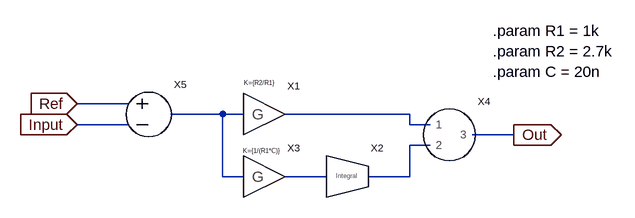
[diagram p0: schematic PI_Controller.asc]
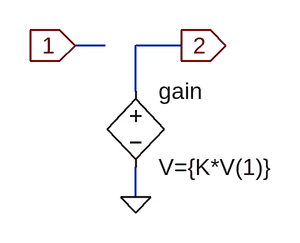
[diagram p1: sub-circuit gain.asc]
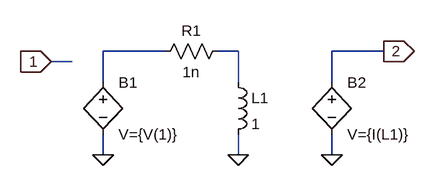
[diagram p2: sub-circuit integral.asc]
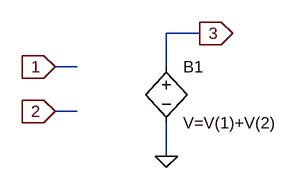
[diagram p3: sub-circuit adder.asc]
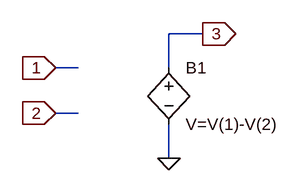
[diagram p4: sub-circuit subtractor.asc]
PI_Controller.asc, the LTspice schematic file:
Version 4
SHEET 1 880 680
WIRE -144 16 -224 16
WIRE 0 32 -80 32
WIRE 32 32 0 32
WIRE 288 32 96 32
WIRE -144 48 -224 48
WIRE 288 48 288 32
WIRE 320 48 288 48
WIRE 448 64 384 64
WIRE 320 80 288 80
WIRE 0 128 0 32
WIRE 32 128 0 128
WIRE 160 128 96 128
WIRE 288 128 288 80
WIRE 288 128 224 128
FLAG -224 16 Ref
IOPIN -224 16 In
FLAG -224 48 Input
IOPIN -224 48 In
FLAG 448 64 Out
IOPIN 448 64 Out
SYMBOL Gain 64 32 R0
WINDOW 39 -31 -48 Left 0
SYMATTR SpiceLine K={R2/R1}
SYMATTR InstName X1
SYMBOL Integral 192 128 R0
SYMATTR InstName X2
SYMBOL Gain 64 128 R0
WINDOW 39 -33 -40 Left 0
SYMATTR SpiceLine K={1/(R1*C)}
SYMATTR InstName X3
SYMBOL adder 352 64 R0
SYMATTR InstName X4
SYMBOL subtractor -112 32 R0
SYMATTR InstName X5
TEXT 416 -96 Left 2 !.param R1 = 1k\n.param R2 = 2.7k\n.param C = 20n

gain.asc, the sub-circuit schematic file:
Version 4
SHEET 1 880 680
WIRE 128 144 96 144
WIRE 208 144 160 144
WIRE 160 192 160 144
WIRE 160 304 160 272
FLAG 96 144 1
IOPIN 96 144 In
FLAG 208 144 2
IOPIN 208 144 Out
FLAG 160 304 0
SYMBOL bv 160 176 R0
SYMATTR InstName gain
SYMATTR Value V={K*V(1)}

integral.asc, the sub-circuit schematic file:
Version 4
SHEET 1 880 680
WIRE 192 112 96 112
WIRE 304 112 272 112
WIRE 528 112 448 112
WIRE 48 128 16 128
WIRE 96 160 96 112
WIRE 304 160 304 112
WIRE 448 160 448 112
WIRE 96 272 96 240
WIRE 304 272 304 240
WIRE 448 272 448 240
FLAG 16 128 1
IOPIN 16 128 In
FLAG 528 112 2
IOPIN 528 112 Out
FLAG 96 272 0
FLAG 304 272 0
FLAG 448 272 0
SYMBOL bv 96 144 R0
SYMATTR InstName B1
SYMATTR Value V={V(1)}
SYMBOL bv 448 144 R0
SYMATTR InstName B2
SYMATTR Value V={I(L1)}
SYMBOL res 288 96 R90
WINDOW 0 0 56 VBottom 2
WINDOW 3 32 56 VTop 2
SYMATTR InstName R1
SYMATTR Value 1n
SYMBOL ind 288 144 R0
SYMATTR InstName L1
SYMATTR Value 1

adder.asc, the sub-circuit schematic file:
Version 4
SHEET 1 880 680
WIRE 176 64 128 64
WIRE 0 112 -32 112
WIRE 128 112 128 64
WIRE 0 176 -32 176
WIRE 128 240 128 192
FLAG -32 112 1
IOPIN -32 112 In
FLAG -32 176 2
IOPIN -32 176 In
FLAG 128 240 0
FLAG 176 64 3
IOPIN 176 64 Out
SYMBOL bv 128 96 R0
SYMATTR InstName B1
SYMATTR Value V=V(1)+V(2)

subtractor.asc, the sub-circuit schematic file:
Version 4
SHEET 1 880 680
WIRE 304 96 256 96
WIRE 128 144 96 144
WIRE 256 144 256 96
WIRE 128 208 96 208
WIRE 256 272 256 224
FLAG 96 144 1
IOPIN 96 144 In
FLAG 96 208 2
IOPIN 96 208 In
FLAG 256 272 0
FLAG 304 96 3
IOPIN 304 96 Out
SYMBOL bv 256 128 R0
SYMATTR InstName B1
SYMATTR Value V=V(1)-V(2)

The netlist it stands for:
* PI_Controller.asc
XX1 N001 N002 gain params: K={R2/R1}
XX2 N004 N003 integral
XX3 N001 N004 gain params: K={1/(R1*C)}
XX4 N002 N003 Out adder
XX5 Ref Input N001 subtractor

* block symbol definitions
.subckt gain 1 2
B§gain 2 0 V={K*V(1)}
.ends gain

.subckt integral 1 2
B1 N001 0 V={V(1)}
B2 2 0 V={I(L1)}
R1 N002 N001 1n
L1 N002 0 1
.ends integral

.subckt adder 1 2 3
B1 3 0 V=V(1)+V(2)
.ends adder

.subckt subtractor 1 2 3
B1 3 0 V=V(1)-V(2)
.ends subtractor

.param R1 = 1k
.param R2 = 2.7k
.param C = 20n
.backanno
.end